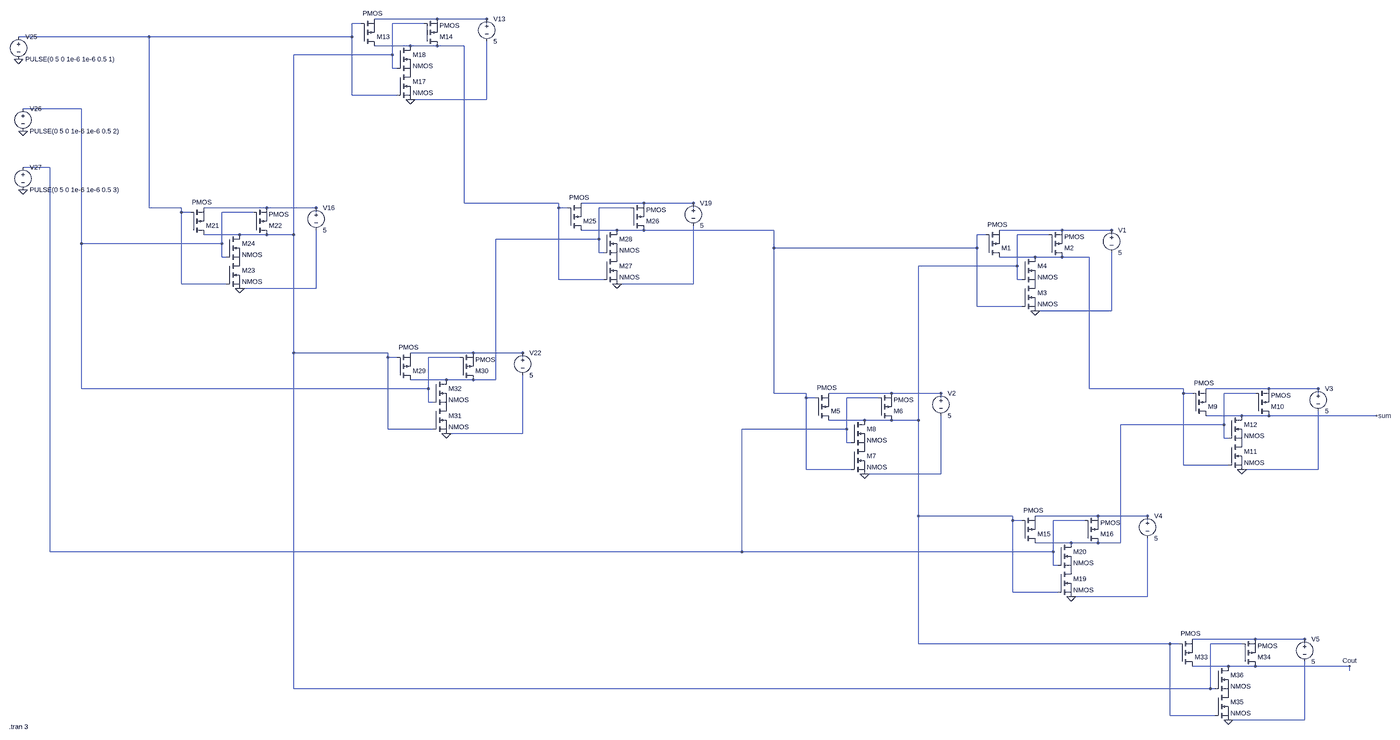
[diagram p0: schematic 1bitfulladderNAND.asc, whole sheet]
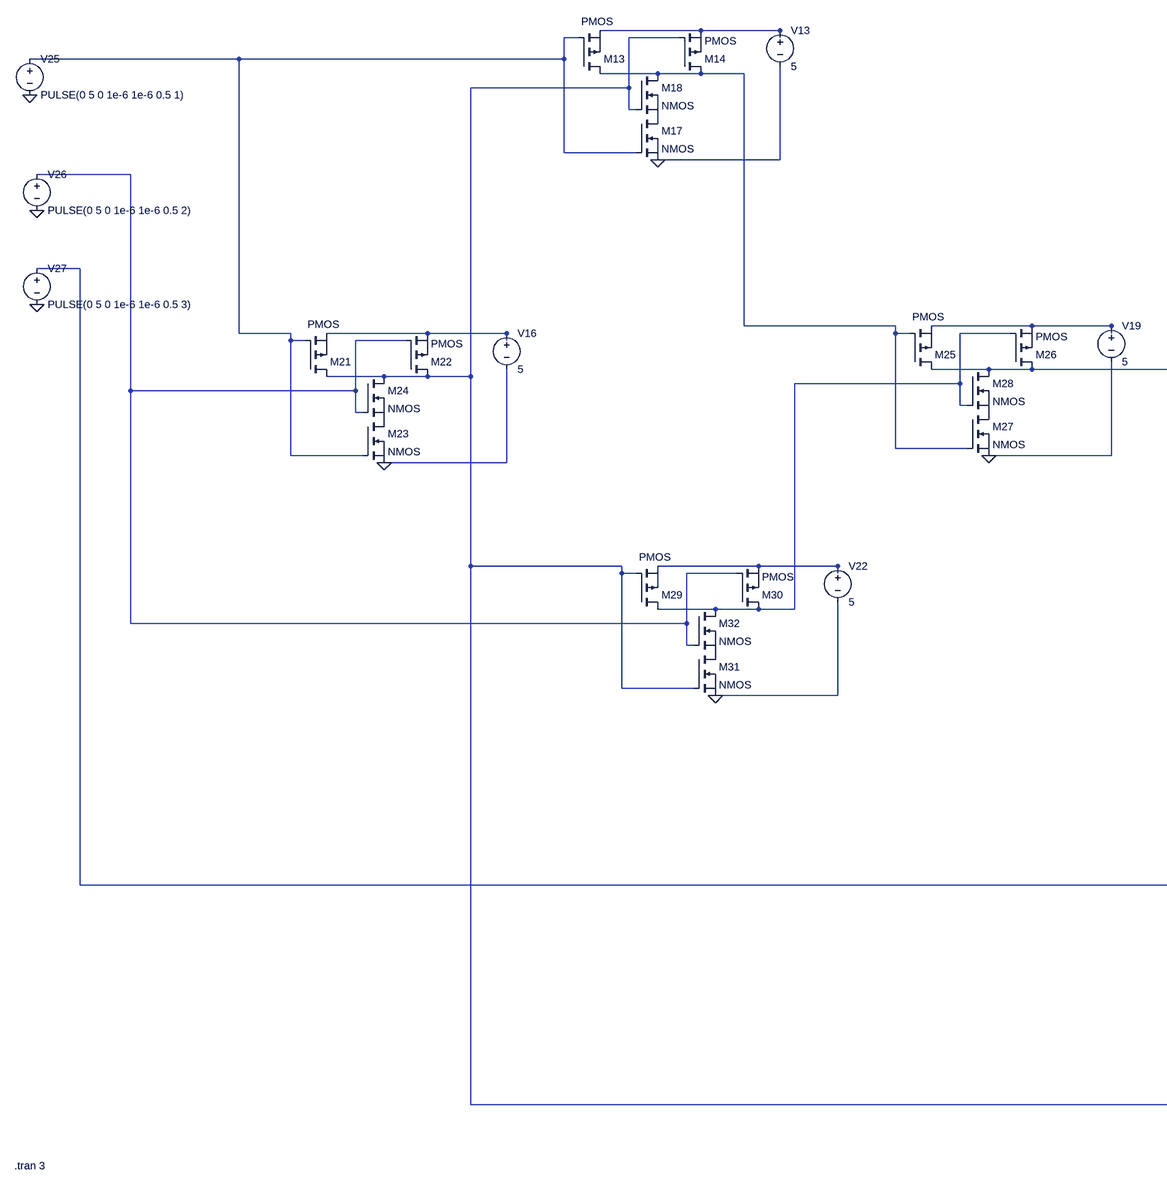
[diagram p1: schematic 1bitfulladderNAND.asc, part, row 1 of 1, column 1 of 2]
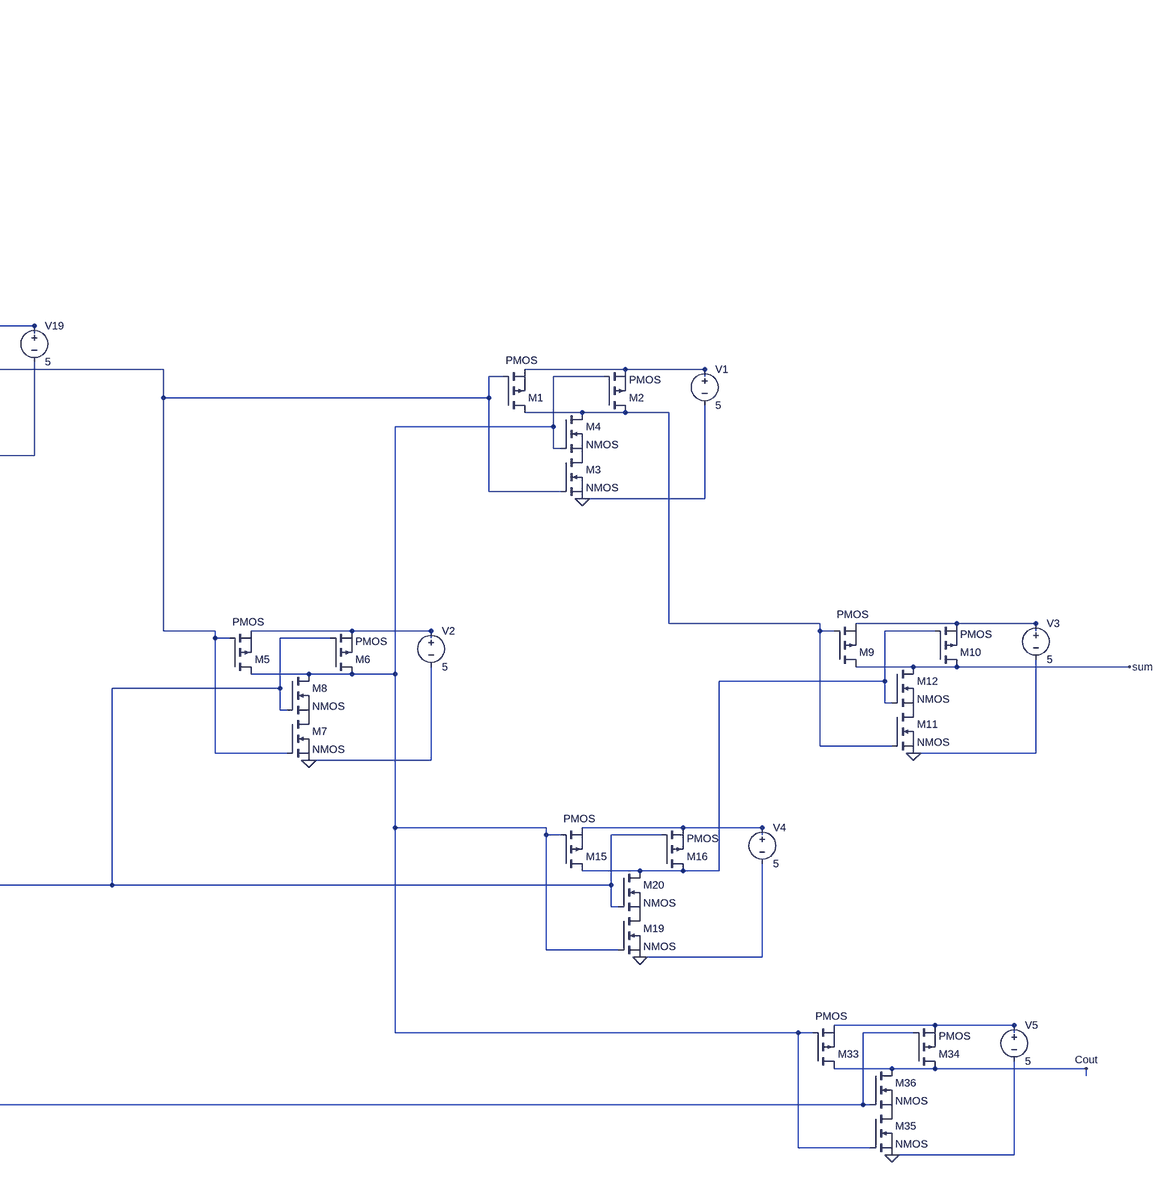
[diagram p2: schematic 1bitfulladderNAND.asc, part, row 1 of 1, column 2 of 2]
1bitfulladderNAND.asc, the LTspice schematic file:
Version 4
SHEET 1 4264 680
WIRE 576 -2704 352 -2704
WIRE 752 -2704 576 -2704
WIRE 304 -2688 272 -2688
WIRE 528 -2688 416 -2688
WIRE 752 -2688 752 -2704
WIRE -496 -2640 -976 -2640
WIRE 272 -2640 272 -2688
WIRE 272 -2640 -496 -2640
WIRE 480 -2608 352 -2608
WIRE 576 -2608 480 -2608
WIRE 672 -2608 576 -2608
WIRE 416 -2576 416 -2688
WIRE 416 -2576 64 -2576
WIRE 416 -2528 416 -2576
WIRE 432 -2528 416 -2528
WIRE 272 -2432 272 -2640
WIRE 432 -2432 272 -2432
WIRE 752 -2416 752 -2624
WIRE 752 -2416 480 -2416
WIRE -752 -2384 -960 -2384
WIRE -864 -2128 -960 -2128
WIRE 672 -2000 672 -2608
WIRE 1008 -2000 672 -2000
WIRE 1312 -2000 1088 -2000
WIRE 1488 -2000 1312 -2000
WIRE -496 -1984 -496 -2640
WIRE -336 -1984 -496 -1984
WIRE -32 -1984 -256 -1984
WIRE 144 -1984 -32 -1984
WIRE 1008 -1984 1008 -2000
WIRE 1040 -1984 1008 -1984
WIRE 1264 -1984 1152 -1984
WIRE 1488 -1984 1488 -2000
WIRE -336 -1968 -336 -1984
WIRE -304 -1968 -336 -1968
WIRE -80 -1968 -192 -1968
WIRE 144 -1968 144 -1984
WIRE 1216 -1904 1088 -1904
WIRE 1312 -1904 1216 -1904
WIRE 2000 -1904 1312 -1904
WIRE 3072 -1904 2848 -1904
WIRE 3248 -1904 3072 -1904
WIRE -128 -1888 -256 -1888
WIRE -32 -1888 -128 -1888
WIRE 64 -1888 64 -2576
WIRE 64 -1888 -32 -1888
WIRE 2800 -1888 2768 -1888
WIRE 3024 -1888 2912 -1888
WIRE 3248 -1888 3248 -1904
WIRE 1152 -1872 1152 -1984
WIRE 1152 -1872 784 -1872
WIRE -752 -1856 -752 -2384
WIRE -192 -1856 -192 -1968
WIRE -192 -1856 -752 -1856
WIRE 2000 -1840 2000 -1904
WIRE 2768 -1840 2768 -1888
WIRE 2768 -1840 2000 -1840
WIRE 1152 -1824 1152 -1872
WIRE 1168 -1824 1152 -1824
WIRE -192 -1808 -192 -1856
WIRE -176 -1808 -192 -1808
WIRE 2976 -1808 2848 -1808
WIRE 3072 -1808 2976 -1808
WIRE 3168 -1808 3072 -1808
WIRE 2912 -1776 2912 -1888
WIRE 2912 -1776 2560 -1776
WIRE 1008 -1728 1008 -1984
WIRE 1168 -1728 1008 -1728
WIRE 2912 -1728 2912 -1776
WIRE 2928 -1728 2912 -1728
WIRE -336 -1712 -336 -1968
WIRE -176 -1712 -336 -1712
WIRE 1488 -1712 1488 -1920
WIRE 1488 -1712 1216 -1712
WIRE 144 -1696 144 -1904
WIRE 144 -1696 -128 -1696
WIRE 2768 -1632 2768 -1840
WIRE 2928 -1632 2768 -1632
WIRE 3248 -1616 3248 -1824
WIRE 3248 -1616 2976 -1616
WIRE 64 -1328 64 -1888
WIRE 400 -1328 64 -1328
WIRE 704 -1328 480 -1328
WIRE 880 -1328 704 -1328
WIRE 400 -1312 400 -1328
WIRE 432 -1312 400 -1312
WIRE 656 -1312 544 -1312
WIRE 880 -1312 880 -1328
WIRE 608 -1232 480 -1232
WIRE 704 -1232 608 -1232
WIRE 784 -1232 784 -1872
WIRE 784 -1232 704 -1232
WIRE -752 -1200 -752 -1856
WIRE 544 -1200 544 -1312
WIRE 544 -1200 -752 -1200
WIRE 3168 -1200 3168 -1808
WIRE 3504 -1200 3168 -1200
WIRE 3808 -1200 3584 -1200
WIRE 3984 -1200 3808 -1200
WIRE 2000 -1184 2000 -1840
WIRE 2160 -1184 2000 -1184
WIRE 2464 -1184 2240 -1184
WIRE 2640 -1184 2464 -1184
WIRE 3504 -1184 3504 -1200
WIRE 3536 -1184 3504 -1184
WIRE 3760 -1184 3648 -1184
WIRE 3984 -1184 3984 -1200
WIRE 2160 -1168 2160 -1184
WIRE 2192 -1168 2160 -1168
WIRE 2416 -1168 2304 -1168
WIRE 2640 -1168 2640 -1184
WIRE 544 -1152 544 -1200
WIRE 560 -1152 544 -1152
WIRE 3712 -1104 3584 -1104
WIRE 3808 -1104 3712 -1104
WIRE 4192 -1104 3808 -1104
WIRE 2368 -1088 2240 -1088
WIRE 2464 -1088 2368 -1088
WIRE 2560 -1088 2560 -1776
WIRE 2560 -1088 2464 -1088
WIRE 3648 -1072 3648 -1184
WIRE 3648 -1072 3280 -1072
WIRE 400 -1056 400 -1312
WIRE 560 -1056 400 -1056
WIRE 2304 -1056 2304 -1168
WIRE 2304 -1056 1744 -1056
WIRE 880 -1040 880 -1248
WIRE 880 -1040 608 -1040
WIRE 3648 -1024 3648 -1072
WIRE 3664 -1024 3648 -1024
WIRE 2304 -1008 2304 -1056
WIRE 2320 -1008 2304 -1008
WIRE 3504 -928 3504 -1184
WIRE 3664 -928 3504 -928
WIRE 2160 -912 2160 -1168
WIRE 2320 -912 2160 -912
WIRE 3984 -912 3984 -1120
WIRE 3984 -912 3712 -912
WIRE 2640 -896 2640 -1104
WIRE 2640 -896 2368 -896
WIRE 2560 -528 2560 -1088
WIRE 2896 -528 2560 -528
WIRE 3200 -528 2976 -528
WIRE 3376 -528 3200 -528
WIRE 2896 -512 2896 -528
WIRE 2928 -512 2896 -512
WIRE 3152 -512 3040 -512
WIRE 3376 -512 3376 -528
WIRE 3104 -432 2976 -432
WIRE 3200 -432 3104 -432
WIRE 3280 -432 3280 -1072
WIRE 3280 -432 3200 -432
WIRE -864 -400 -864 -2128
WIRE 1744 -400 1744 -1056
WIRE 1744 -400 -864 -400
WIRE 3040 -400 3040 -512
WIRE 3040 -400 1744 -400
WIRE 3040 -352 3040 -400
WIRE 3056 -352 3040 -352
WIRE 2896 -256 2896 -512
WIRE 3056 -256 2896 -256
WIRE 3376 -240 3376 -448
WIRE 3376 -240 3104 -240
WIRE 3760 80 3536 80
WIRE 3936 80 3760 80
WIRE 2560 96 2560 -528
WIRE 3456 96 2560 96
WIRE 3488 96 3456 96
WIRE 3712 96 3600 96
WIRE 3936 96 3936 80
WIRE 3664 176 3536 176
WIRE 3760 176 3664 176
WIRE 4096 176 3760 176
WIRE 4096 192 4096 176
WIRE 64 256 64 -1328
WIRE 3600 256 3600 96
WIRE 3600 256 64 256
WIRE 3616 256 3600 256
WIRE 3456 352 3456 96
WIRE 3616 352 3456 352
WIRE 3936 368 3936 160
WIRE 3936 368 3664 368
FLAG 480 -2416 0
FLAG -128 -1696 0
FLAG 1216 -1712 0
FLAG 608 -1040 0
FLAG -976 -2560 0
FLAG -960 -2304 0
FLAG -960 -2048 0
FLAG 2976 -1616 0
FLAG 2368 -896 0
FLAG 3712 -912 0
FLAG 3104 -240 0
FLAG 3664 368 0
FLAG 4192 -1104 sum
FLAG 4096 176 Cout
SYMBOL pmos 304 -2608 M180
WINDOW 3 6 116 Left 2
SYMATTR InstName M13
SYMBOL pmos 528 -2608 M180
SYMATTR InstName M14
SYMBOL voltage 752 -2720 R0
WINDOW 123 0 0 Left 2
WINDOW 39 0 0 Left 2
SYMATTR InstName V13
SYMATTR Value 5
SYMBOL nmos 432 -2512 R0
SYMATTR InstName M17
SYMBOL nmos 432 -2608 R0
SYMATTR InstName M18
SYMBOL pmos -304 -1888 M180
WINDOW 3 6 116 Left 2
SYMATTR InstName M21
SYMBOL pmos -80 -1888 M180
SYMATTR InstName M22
SYMBOL voltage 144 -2000 R0
WINDOW 123 0 0 Left 2
WINDOW 39 0 0 Left 2
SYMATTR InstName V16
SYMATTR Value 5
SYMBOL nmos -176 -1792 R0
SYMATTR InstName M23
SYMBOL nmos -176 -1888 R0
SYMATTR InstName M24
SYMBOL pmos 1040 -1904 M180
WINDOW 3 6 116 Left 2
SYMATTR InstName M25
SYMBOL pmos 1264 -1904 M180
SYMATTR InstName M26
SYMBOL voltage 1488 -2016 R0
WINDOW 123 0 0 Left 2
WINDOW 39 0 0 Left 2
SYMATTR InstName V19
SYMATTR Value 5
SYMBOL nmos 1168 -1808 R0
SYMATTR InstName M27
SYMBOL nmos 1168 -1904 R0
SYMATTR InstName M28
SYMBOL pmos 432 -1232 M180
WINDOW 3 6 116 Left 2
SYMATTR InstName M29
SYMBOL pmos 656 -1232 M180
SYMATTR InstName M30
SYMBOL voltage 880 -1344 R0
WINDOW 123 0 0 Left 2
WINDOW 39 0 0 Left 2
SYMATTR InstName V22
SYMATTR Value 5
SYMBOL nmos 560 -1136 R0
SYMATTR InstName M31
SYMBOL nmos 560 -1232 R0
SYMATTR InstName M32
SYMBOL voltage -976 -2656 R0
WINDOW 123 0 0 Left 2
WINDOW 39 0 0 Left 2
SYMATTR InstName V25
SYMATTR Value PULSE(0 5 0 1e-6 1e-6 0.5 1)
SYMBOL voltage -960 -2400 R0
WINDOW 123 0 0 Left 2
WINDOW 39 0 0 Left 2
SYMATTR InstName V26
SYMATTR Value PULSE(0 5 0 1e-6 1e-6 0.5 2)
SYMBOL voltage -960 -2144 R0
WINDOW 123 0 0 Left 2
WINDOW 39 0 0 Left 2
SYMATTR InstName V27
SYMATTR Value PULSE(0 5 0 1e-6 1e-6 0.5 3)
SYMBOL pmos 2800 -1808 M180
WINDOW 3 6 116 Left 2
SYMATTR InstName M1
SYMBOL pmos 3024 -1808 M180
SYMATTR InstName M2
SYMBOL voltage 3248 -1920 R0
WINDOW 123 0 0 Left 2
WINDOW 39 0 0 Left 2
SYMATTR InstName V1
SYMATTR Value 5
SYMBOL nmos 2928 -1712 R0
SYMATTR InstName M3
SYMBOL nmos 2928 -1808 R0
SYMATTR InstName M4
SYMBOL pmos 2192 -1088 M180
WINDOW 3 6 116 Left 2
SYMATTR InstName M5
SYMBOL pmos 2416 -1088 M180
SYMATTR InstName M6
SYMBOL voltage 2640 -1200 R0
WINDOW 123 0 0 Left 2
WINDOW 39 0 0 Left 2
SYMATTR InstName V2
SYMATTR Value 5
SYMBOL nmos 2320 -992 R0
SYMATTR InstName M7
SYMBOL nmos 2320 -1088 R0
SYMATTR InstName M8
SYMBOL pmos 3536 -1104 M180
WINDOW 3 6 116 Left 2
SYMATTR InstName M9
SYMBOL pmos 3760 -1104 M180
SYMATTR InstName M10
SYMBOL voltage 3984 -1216 R0
WINDOW 123 0 0 Left 2
WINDOW 39 0 0 Left 2
SYMATTR InstName V3
SYMATTR Value 5
SYMBOL nmos 3664 -1008 R0
SYMATTR InstName M11
SYMBOL nmos 3664 -1104 R0
SYMATTR InstName M12
SYMBOL pmos 2928 -432 M180
WINDOW 3 6 116 Left 2
SYMATTR InstName M15
SYMBOL pmos 3152 -432 M180
SYMATTR InstName M16
SYMBOL voltage 3376 -544 R0
WINDOW 123 0 0 Left 2
WINDOW 39 0 0 Left 2
SYMATTR InstName V4
SYMATTR Value 5
SYMBOL nmos 3056 -336 R0
SYMATTR InstName M19
SYMBOL nmos 3056 -432 R0
SYMATTR InstName M20
SYMBOL pmos 3488 176 M180
WINDOW 3 6 116 Left 2
SYMATTR InstName M33
SYMBOL pmos 3712 176 M180
SYMATTR InstName M34
SYMBOL voltage 3936 64 R0
WINDOW 123 0 0 Left 2
WINDOW 39 0 0 Left 2
SYMATTR InstName V5
SYMATTR Value 5
SYMBOL nmos 3616 272 R0
SYMATTR InstName M35
SYMBOL nmos 3616 176 R0
SYMATTR InstName M36
TEXT -1010 392 Left 2 !.tran 3

The netlist it stands for:
* 1bitfulladderNAND.asc
M13 N004 N002 N001 N001 PMOS
M14 N004 N003 N001 N001 PMOS
V13 N001 0 5
M17 P001 N002 0 0 NMOS
M18 N004 N003 P001 P001 NMOS
M21 N003 N002 N008 N008 PMOS
M22 N003 N005 N008 N008 PMOS
V16 N008 0 5
M23 P002 N002 0 0 NMOS
M24 N003 N005 P002 P002 NMOS
M25 N010 N004 N007 N007 PMOS
M26 N010 N009 N007 N007 PMOS
V19 N007 0 5
M27 P003 N004 0 0 NMOS
M28 N010 N009 P003 P003 NMOS
M29 N009 N003 N014 N014 PMOS
M30 N009 N005 N014 N014 PMOS
V22 N014 0 5
M31 P004 N003 0 0 NMOS
M32 N009 N005 P004 P004 NMOS
V25 N002 0 PULSE(0 5 0 1e-6 1e-6 0.5 1)
V26 N005 0 PULSE(0 5 0 1e-6 1e-6 0.5 2)
V27 N006 0 PULSE(0 5 0 1e-6 1e-6 0.5 3)
M1 N013 N010 N011 N011 PMOS
M2 N013 N012 N011 N011 PMOS
V1 N011 0 5
M3 P005 N010 0 0 NMOS
M4 N013 N012 P005 P005 NMOS
M5 N012 N010 N016 N016 PMOS
M6 N012 N006 N016 N016 PMOS
V2 N016 0 5
M7 P006 N010 0 0 NMOS
M8 N012 N006 P006 P006 NMOS
M9 sum N013 N015 N015 PMOS
M10 sum N017 N015 N015 PMOS
V3 N015 0 5
M11 P007 N013 0 0 NMOS
M12 sum N017 P007 P007 NMOS
M15 N017 N012 N018 N018 PMOS
M16 N017 N006 N018 N018 PMOS
V4 N018 0 5
M19 P008 N012 0 0 NMOS
M20 N017 N006 P008 P008 NMOS
M33 Cout N012 N019 N019 PMOS
M34 Cout N003 N019 N019 PMOS
V5 N019 0 5
M35 P009 N012 0 0 NMOS
M36 Cout N003 P009 P009 NMOS
.model NMOS NMOS
.model PMOS PMOS
.lib standard.mos
.tran 3
.backanno
.end